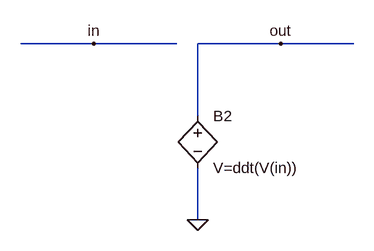
[diagram p0: schematic ideal_diff.asc]
ideal_diff.asc, the LTspice schematic file:
Version 4
SHEET 1 2652 680
WIRE 528 32 416 32
WIRE 656 32 528 32
WIRE 816 32 688 32
WIRE 928 32 816 32
WIRE 688 144 688 32
WIRE 688 304 688 224
FLAG 688 304 0
FLAG 528 32 in
FLAG 816 32 out
SYMBOL bv 688 128 R0
SYMATTR InstName B2
SYMATTR Value V=ddt(V(in))

The netlist it stands for:
* ideal_diff.asc
B2 out 0 V=ddt(V(in))
.backanno
.end